# EasyEDA Pro project DCP_main.eprj, schematic Schematic1
Board Name: RCBO; Create Date: 2025-11-18; Page Name: P1; Project Name: DCP_main; Schematic Name: Schematic1; Update Date: 2025-11-24; Company: 嘉立创EDA; Page Size: A4; Version: V1.0
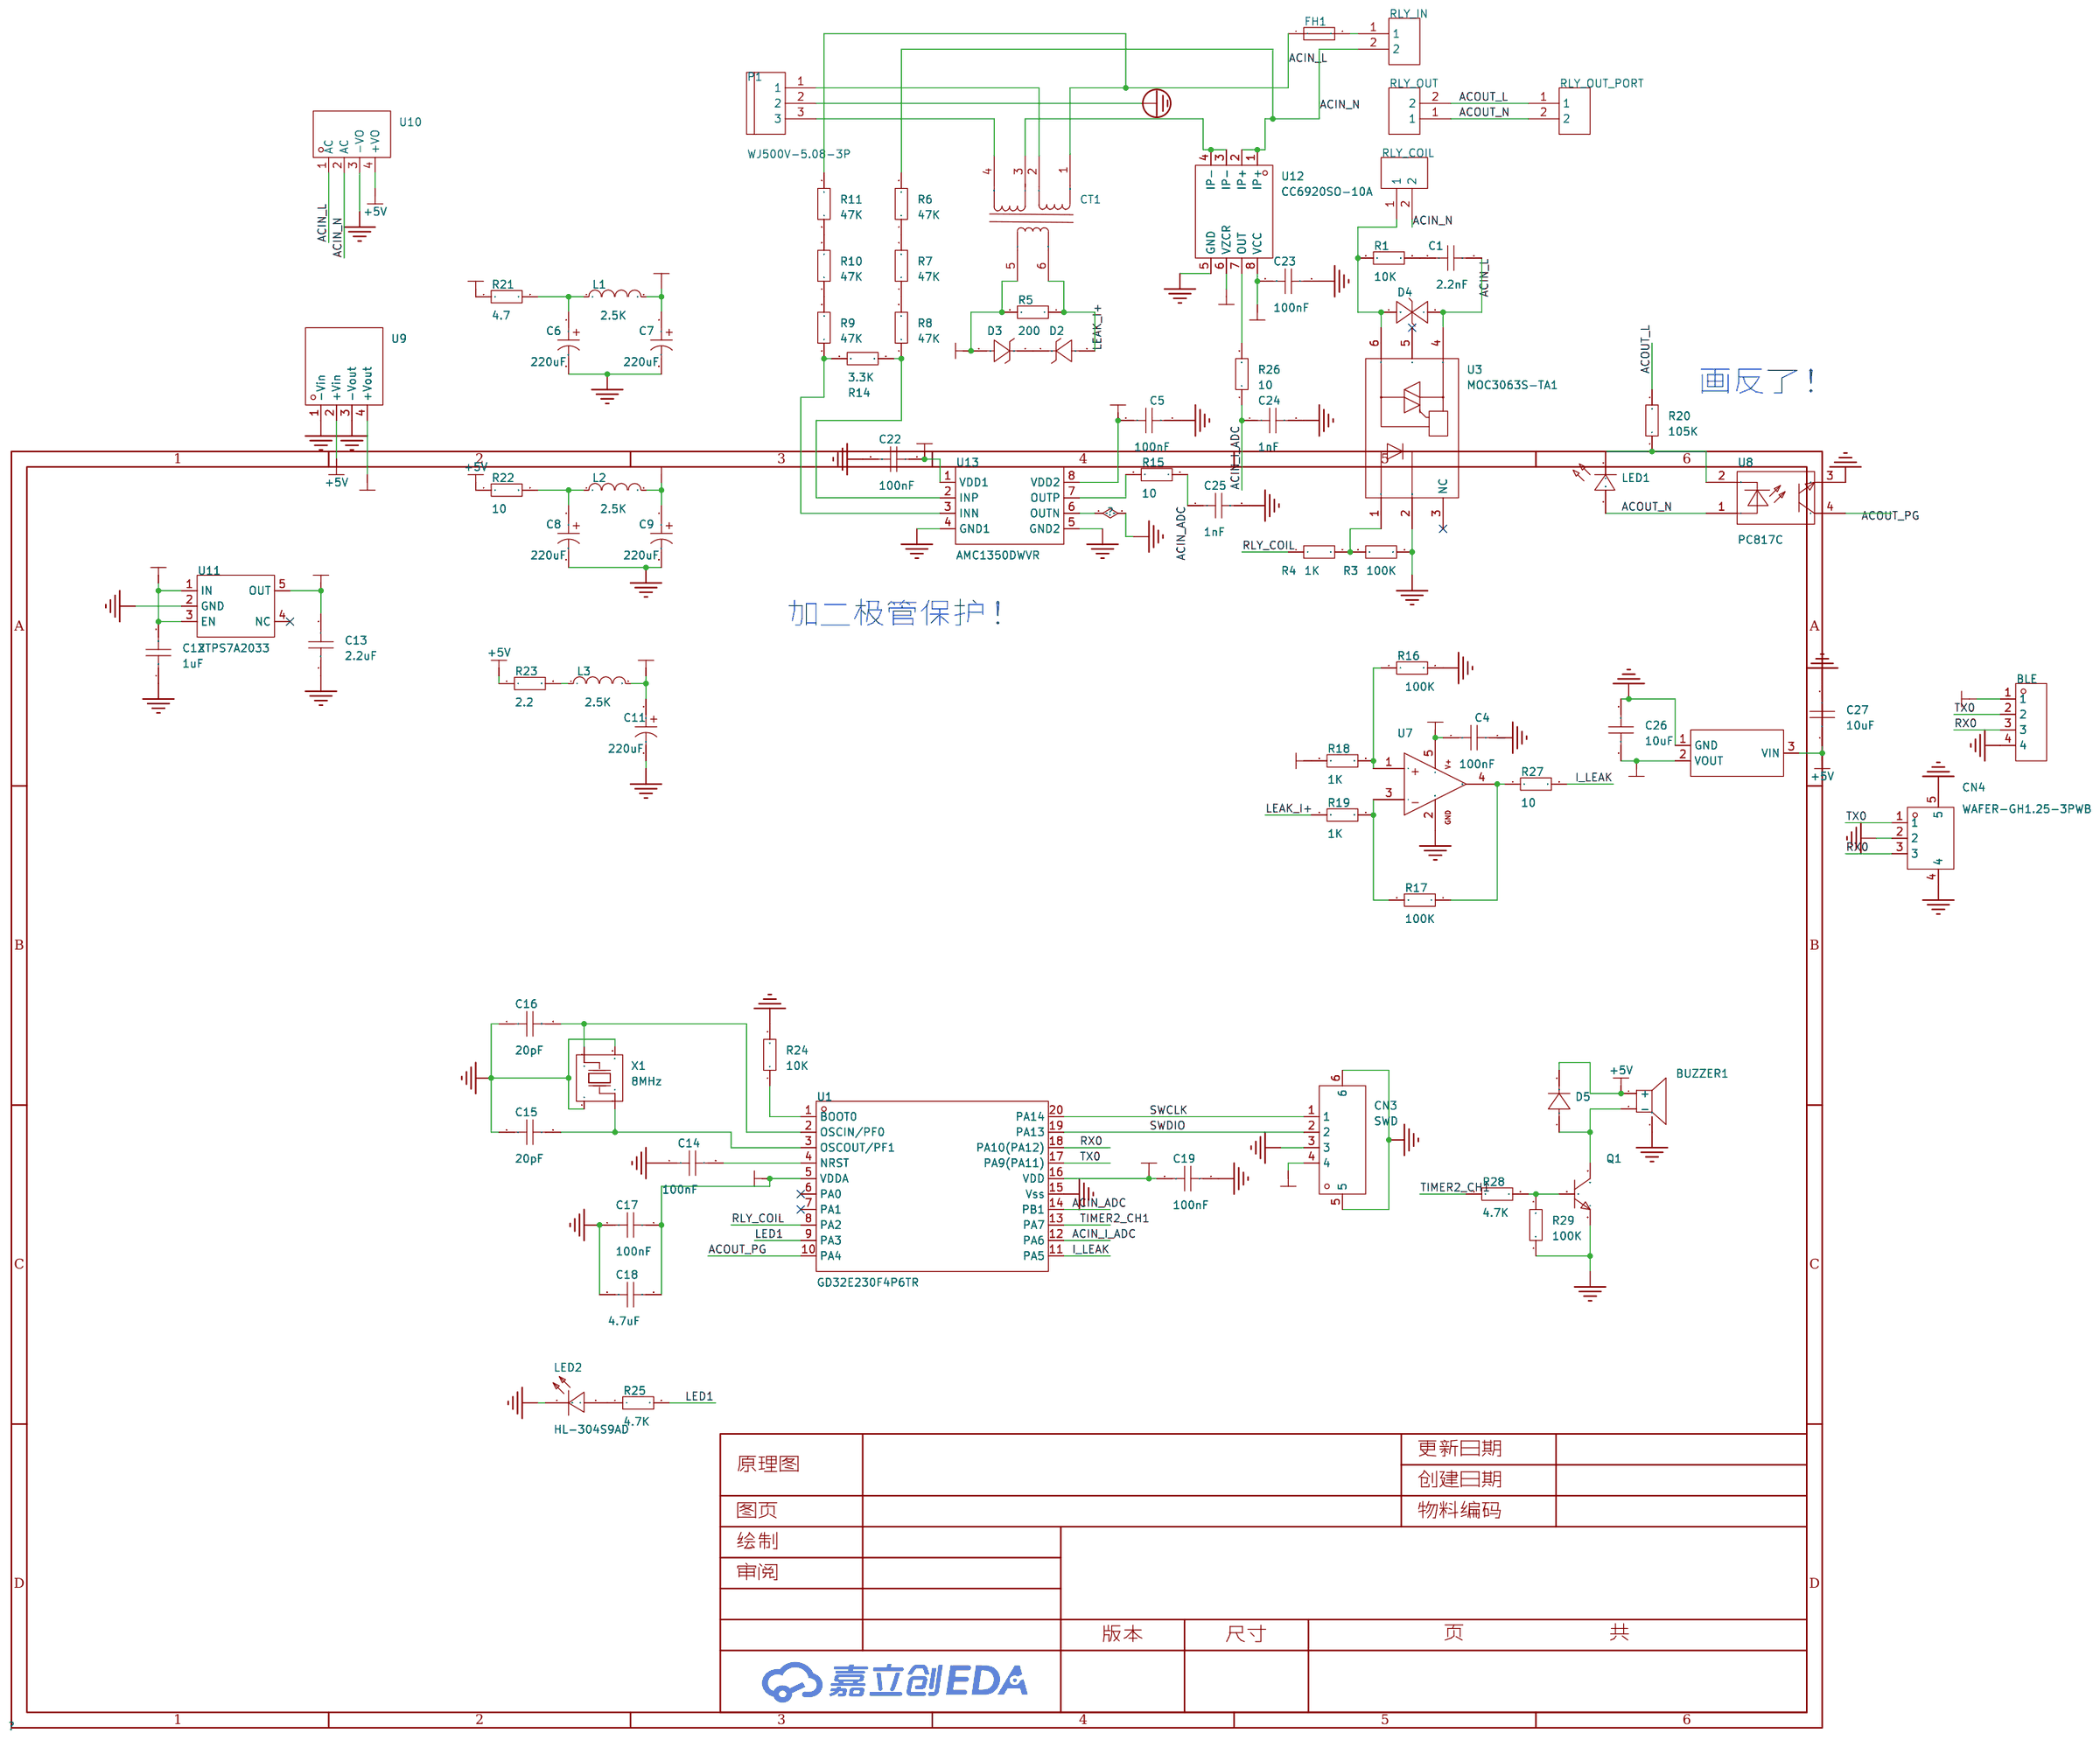
[diagram p0: schematic sheet]

## Parts
BLE  -  [HDR-TH_4P-P2.54-V-F]
BUZZER1  4kHz  [BUZ-SMD_L5.0-W5.5-P4.60]
C1  2.2nF  [CAP-TH_L6.5-W4.0-P5.0-D0.5]
C4  100nF  [C0603]
C5  100nF  [C0603]
C6  220uF  [CAP-SMD_BD6.3-L6.6-W6.6-LS7.4-FD]
C7  220uF  [CAP-SMD_BD6.3-L6.6-W6.6-LS7.4-FD]
C8  220uF  [CAP-SMD_BD6.3-L6.6-W6.6-LS7.4-FD]
C9  220uF  [CAP-SMD_BD6.3-L6.6-W6.6-LS7.4-FD]
C11  220uF  [CAP-SMD_BD6.3-L6.6-W6.6-LS7.4-FD]
C12  1uF  [C0603]
C13  2.2uF  [C0603]
C14  100nF  [C0603]
C15  20pF  [C0603]
C16  20pF  [C0603]
C17  100nF  [C0603]
C18  4.7uF  [C0603]
C19  100nF  [C0603]
C22  100nF  [C0603]
C23  100nF  [C0603]
C24  1nF  [C0603]
C25  1nF  [C0603]
C26  10uF  [C0603]
C27  10uF  [C0603]
CN3  SWD  [CONN-SMD_4P-P1.27_GH125-S04DCA-00]
CN4  WAFER-GH1.25-3PWB  [CONN-TH_3P-P1.25_GH1.25]
CT1  -  [GL-MXNZ06]
D2  ZMM3V3  [LL-34_L3.5-W1.5-RD]
D3  ZMM3V3  [LL-34_L3.5-W1.5-RD]
D4  SMBJ18CA  [SMB_L4.6-W3.6-LS5.3-BI]
D5  1N4148WS  [SOD-323_L1.7-W1.3-LS2.5-FD]
FH1  PTF-15  [FUSE-TH_L22.0-W9.0-P22.60]
L1  2.5K  [L0603]
L2  2.5K  [L0603]
L3  2.5K  [L0603]
LED1  -  [LED_TH-3mm]
LED2  HL-304S9AD  [LED-TH_BD3.0-P2.54-FD]
P1  WJ500V-5.08-3P  [CONN-TH_3P-P5.00_WJ500V-5.08-3P]
Q1  S8050  [SOT-23-3_L3.0-W1.7-P0.95-LS2.9-BR]
R1  10K  [RES_MF1W_L_4.5MM]
R3  100K  [R0603]
R4  1K  [R0603]
R5  200  [R0603]
R6  47K  [R0805]
R7  47K  [R0805]
R8  47K  [R0805]
R9  47K  [R0805]
R10  47K  [R0805]
R11  47K  [R0805]
R14  3.3K  [R0603]
R15  10  [R0603]
R16  100K  [R0603]
R17  100K  [R0603]
R18  1K  [R0603]
R19  1K  [R0603]
R20  105K  [RES_MF1W_L_4.5MM]
R21  4.7  [R0603]
R22  10  [R0603]
R23  2.2  [R0603]
R24  10K  [R0603]
R25  4.7K  [R0603]
R26  10  [R0603]
R27  10  [R0603]
R28  4.7K  [R0603]
R29  100K  [R0603]
RLY_COIL  WJ500V-5.08-2P  [CONN-TH_2P-P5.00_WJ500V-5.08-2P]
RLY_IN  WJ500V-5.08-2P  [CONN-TH_2P-P5.00_WJ500V-5.08-2P]
RLY_OUT  WJ500V-5.08-2P  [CONN-TH_2P-P5.00_WJ500V-5.08-2P]
RLY_OUT_PORT  WJ500V-5.08-2P  [CONN-TH_2P-P5.00_WJ500V-5.08-2P]
U1  GD32E230F4P6TR  [TSSOP-20_L6.5-W4.4-P0.65-LS6.4-BL]
U3  MOC3063S-TA1  [SMD-6_L7.3-W6.5-P2.54-LS10.2-BL]
U7  LMV321IDBVR  [SOT-23-5_L3.0-W1.7-P0.95-LS2.8-BR]
U8  PC817C  [OPTO-SMD-4_L4.6-W6.5-P2.54-LS10.3-TL]
U9  B0505S-1WR3  [PWRM-TH_B0505S-1WR3]
U10  HLK-2M05  [PWRM-TH_HLK-2M05]
U11  XTPS7A2033  [SOT-23-5_L3.0-W1.7-P0.95-LS2.8-BL]
U12  CC6920SO-10A  [SOP-8_L5.0-W4.0-P1.27-LS6.2-BL]
U13  AMC1350DWVR  [SOPW8_L7.5-W5.8-P1.27-LS11.5-TL]
U14  SGM2203-3.3YN3LG/TR  [SOT-23-3_L2.9-W1.3-P1.90-LS2.4-BL-3]
X1  8MHz  [OSC-SMD_4P-L3.2-W2.5-BL]

## Library data of the parts
BLE = HDR-F_2.54_1x4P: Supplier Part: C2718488; Supplier Footprint: 插件
BUZZER1 = MLT-5020: LCSC Part Name: 无源(外部驱动) 电磁式 4kHz; Supplier Part: C94598; Manufacturer: 华能; Supplier Footprint: SMD,5x5mm; JLCPCB Part Class: 扩展库; Datasheet: https://item.szlcsc.com/datasheet/MLT-5020/95796.html; Supplier: LCSC; Driver Circuitry: 无源(外部驱动); Technology: 电磁式; Voltage Rating: 3V; Voltage - Supply: 2V~4V; Current Consumption: 100mA; Sound Pressure Level(SPL): 75dB; Length: 5.2mm; Width: 5.2mm; Height: 2.5mm; Operating Temperature: -20℃~+70℃
C1 = Y5V222M1KV16CC0035: LCSC Part Name: 2.2nF ±20% 1kV; Supplier Part: C2887269; Manufacturer: KNSCHA(科尼盛); Supplier Footprint: 插件,P=5mm; JLCPCB Part Class: 扩展库; Datasheet: https://item.szlcsc.com/datasheet/Y5V222M1KV16CC0035/3103837.html; Supplier: LCSC; Tolerance: ±20%; Voltage Rating: 1kV; Pin Spacing: 5mm; Temperature Coefficient: SL
C4 C5 C12-C19 C22-C27 = CAP_0603: Supplier Footprint: 0603
C6-C9 C11 = JBLM2221M010C058RTM 220UF 10V: LCSC Part Name: 220uF ±20% 10V; Supplier Part: C19270700; Manufacturer: DMBJ(振宝佳); Supplier Footprint: SMD,D6.3xL5.8mm; JLCPCB Part Class: 扩展库; Datasheet: https://item.szlcsc.com/datasheet/JBLM2221M010C058RTM%2520220UF%252010V/20537890.html; Supplier: LCSC; Tolerance: ±20%; Voltage Rating: 10V; Ripple Current: 2.65A@100kHz; Equivalent Series Resistance(ESR): 35mΩ@100kHz; Diameter: 6.3mm; Height - Seated (Max): 5.8mm; Lifetime: 2000hrs@105℃
CN3 = GH125-S04DCA-00: 参考系列:-;间距:1.25mm;插针结构:1x4P;排数:1;每排PIN数:4;行距:-;公母:公型插针;安装方式:卧贴;额定电流:1A;工作温度范围:-25℃~+85℃;; LCSC Part Name: GH1.25卧式贴片 带扣; Supplier Part: C2886767; Manufacturer: JS(钜硕电子); Supplier Footprint: SMD,P=1.25mm; JLCPCB Part Class: Extended Part; Datasheet: https://atta.szlcsc.com/upload/public/pdf/source/20210818/CD11791E5ED3EDF45A7009E9C8A2BD4C.pdf; Supplier: LCSC; Pitch: 1.25mm; Pins Structure: 1x4P; Number of Rows: 1; Number of PINs Per Row: 4; Gender: 公型插针; Mounting Style: 卧贴; Current Rating (Max): 1A; Operating Temperature Range: -25℃~+85℃
CN4 = WAFER-GH1.25-3PWB: LCSC Part Name: 1x3P 间距:1.25mm 卧贴 系列:GH; Supplier Part: C3029378; Manufacturer: XUNPU(讯普); Supplier Footprint: SMD,P=1.25mm,卧贴; JLCPCB Part Class: 扩展库; Datasheet: https://item.szlcsc.com/datasheet/WAFER-GH1.25-3PWB/3561390.html; Supplier: LCSC; Pins Structure: 1x3P; Pitch: 1.25mm; Mounting Type: 卧贴; Reference Series: GH; Number of Pins: 3P; Number of Rows: 1; Number of PINs Per Row: 3; Current Rating: 1A; Contact Material: 黄铜; Contact Plating: 锡; Operating Temperature: -25℃~+85℃; Voltage Rating: 125V; Plastic Material: LCP; Supplementary Features: 辅助焊脚; Color: 米色; Z-Height of the Board: 4.35mm; X-Length of Bottom Edge on Board (Spacing Line): 7mm; Y-Width of Bottom Edge on Board: 5mm
CT1 = 互感器MXNZ06
D2 D3 = ZMM3V3_C707189: LCSC Part Name: 独立式 耐压:3.3V 电流:2uA; Supplier Part: C707189; Manufacturer: Slkor(萨科微); Supplier Footprint: LL-34; JLCPCB Part Class: 扩展库; Datasheet: https://item.szlcsc.com/datasheet/ZMM3V3/744311.html; Supplier: LCSC; Diode Configuration: 独立式; Zener Voltage(Nom): 3.3V; Reverse Leakage Current (Ir): 2uA; Zener Voltage(Range): 3.1V~3.5V; Pd - Power Dissipation: 500mW; Impedance(Zzt): 85Ω; Impedance(Zzk): 600Ω
D4 = SMBJ18CA_C699019: Supplier Part: C699019; Manufacturer: YANGJIE(扬杰); Supplier Footprint: SMB(DO-214AA); JLCPCB Part Class: 扩展库; Datasheet: https://atta.szlcsc.com/upload/public/pdf/source/20190118/C340697_21AC0267120ED75466CB2B39690E90FA.pdf; Supplier: LCSC; Reverse Stand-Off Voltage (Vrwm): 18V; Maximum Clamping Voltage: 29.2V; Peak Pulse Current (Ipp): 20.55A; Peak Pulse Power Dissipation (Ppp): 600W; Breakdown Voltage: 20V; Type: TVS
D5 = 1N4148WS_C7420319: Supplier Part: C7420319; Manufacturer: R+O(宏嘉诚); Supplier Footprint: SOD-323; JLCPCB Part Class: 扩展库; Datasheet: https://item.szlcsc.com/datasheet/1N4148WS/8397141.html; Supplier: LCSC; Diode Configuration: 独立式; Voltage - Forward(Vf@If): 1.25V@150mA; Voltage - DC Reverse(Vr): 100V; Current - Rectified: 150mA; Pd - Power Dissipation: 200mW; Reverse Leakage Current (Ir): 1uA@75V; Reverse Recovery Time (trr): 4ns; Operating Junction Temperature Range: -55℃~+150℃; Non-Repetitive Peak Forward Surge Current: 2A
FH1 = PTF-15: LCSC Part Name: 两件套 保险丝座 5x20mm 白色盖 二件套; Supplier Part: C842712; Manufacturer: XFCN(兴飞); Supplier Footprint: 插件,P=22.6mm; JLCPCB Part Class: 扩展库; Datasheet: https://atta.szlcsc.com/upload/public/pdf/source/20211009/012EEC364944A1D424B5148AD750D865.pdf; Supplier: LCSC; Voltage Rating: 250V; Current Rating: 6.3A
L1-L3 = L_0603
LED1 = LED_TH-R_3mm: Supplier Footprint: 插件
LED2 = HL-304S9AD: 灯头类型:3mm圆形灯头;发光颜色:红色;正向电压(VF):2.2V;功率:66mW;正向电流:20mA;主波长:627nm~635nm;二极管配置:-;透镜颜色:雾状红透镜;色温:-;发光强度:460mcd;发光角度:40°;载带方式:-;工作温度:-30℃~+80℃;; Supplier Part: C568936; Manufacturer: HONGLITRONIC(鸿利光电); Supplier Footprint: 插件,D=3mm; JLCPCB Part Class: 扩展库; Datasheet: https://atta.szlcsc.com/upload/public/pdf/source/20200630/C568936_361459151DDEDF72172B9683A2A9AC96.pdf; Supplier: LCSC; Lamp Holder Type: 3mm圆形灯头; Emitted Color: 红色; Forward Voltage (VF): 2.2V; Power Dissipation: 66mW; Forward Current: 20mA; Dominant Wavelength: 627nm~635nm; Lens Color: 雾状红透镜; Luminous Intensity: 460mcd; Viewing Angle: 40°; Operating Temperature: -30℃~+80℃
P1 = WJ500V-5.08-3P: LCSC Part Name: 5.08mm 1x3P 排数:1 每排P数:3 直插; Supplier Part: C72334; Manufacturer: KANGNEX(康奈克斯电气); Supplier Footprint: 插件,P=5.08mm; JLCPCB Part Class: 扩展库; Datasheet: https://item.szlcsc.com/datasheet/WJ500V-5.08-3P/73443.html; Supplier: LCSC; Number of Positions or Pins: 1x3P; Pitch: 5.08mm; Color: 绿色; Mounting Type: 直插; Number of Pins: 3P; Number of Rows: 1; Number of PINs Per Row: 3; Current Rating: 18A; Voltage Rating (Max): 250V; Wire Gauge - AWG: 14~30; Wire Gauge - mm2: 2.5; Operating Temperature: -40℃~+105℃
Q1 = S8050_C364312: LCSC Part Name: hFE:200-350 NPN 电流:500mA 电压:25V; Supplier Part: C364312; Manufacturer: MDD(辰达半导体); Supplier Footprint: SOT-23; JLCPCB Part Class: 扩展库; Datasheet: https://item.szlcsc.com/datasheet/S8050/338624.html; Supplier: LCSC; type: NPN; Current - Collector(Ic): 500mA; Collector - Emitter Voltage VCEO: 25V; Pd - Power Dissipation: 300mW; Transition frequency(fT): 150MHz; Current - Collector Cutoff: 100nA; Vce Saturation(VCE(sat)): 600mV@500mA,50mA; Operating Temperature: -55℃~+150℃; Emitter-Base Voltage(Vebo): 5V
R1 R3-R5 R14-R29 = Res_0603: Supplier Footprint: 0603
R6-R11 = Res_0805: Supplier Footprint: 0805
RLY_COIL RLY_IN RLY_OUT RLY_OUT_PORT = WJ500V-5.08-2P: LCSC Part Name: 1x2P 5.08mm 直插 排数:1 每排P数:2; Supplier Part: C8465; Manufacturer: KANGNEX(康奈克斯电气); Supplier Footprint: 插件,P=5.08mm; JLCPCB Part Class: 扩展库; Datasheet: https://atta.szlcsc.com/upload/public/pdf/source/20191225/C8465_02D34CE5B5B4A53DF5891601D97FA9F4.pdf; Supplier: LCSC; Structure: 1x2P; Pitch: 5.08mm; Color: 绿色; Mounting Style: 直插; Current Rating (Max): 18A; Voltage Rating (Max): 250V; Number of Pins: 2P; Number of Rows: 1; Wire Gauge - AWG: 14~30; Wire Gauge - mm2: 2.5; Number of PINs Per Row: 2; Operating Temperature Range: -40℃~+105℃; Screw Specification: M2.5
U1 = GD32E230F4P6TR: CPU内核:-;程序存储容量:16KB;RAM总容量:4KB;GPIO端口数量:15;工作电压范围:1.8V~3.6V;CPU最大主频:72MHz;程序存储器类型:FLASH;; Supplier Part: C2842295; Manufacturer: GigaDevice(兆易创新); Supplier Footprint: TSSOP-20; JLCPCB Part Class: 扩展库; Datasheet: https://atta.szlcsc.com/upload/public/pdf/source/20240402/A7F4CC4CD3D7DC7CD15A7FB0DE571B27.pdf; Supplier: LCSC; Program Storage Size: 16KB; RAM Size: 4KB; GPIO Ports Number: 15; Operating Voltage Range: 1.8V~3.6V; CPU Maximum Speed: 72MHz; Program Memory Type: FLASH; Operating Temperature Range: -40℃~+85℃; ADC (Bit): 12bit; PWM (Bit): 16bit; 16Bit Timer: 5; UART/USART: 1; I2C: 1; SPI: 1; Internal Comparator: 有; Peripheral/Function: 温度传感器；DMA；看门狗；LIN总线协议；PWM；IrDA；RTC实时时钟; Watchdog: 有; Real-Time Clock: 有; Infrared Data Association: 有; Direct Memory Access: 有; Internal Oscillator: 有
U3 = MOC3063S-TA1: LCSC Part Name: 双向可控硅 有过零电路 1通道; Supplier Part: C77950; Manufacturer: LITEON(光宝); Supplier Footprint: SMD-6P; JLCPCB Part Class: 扩展库; Datasheet: https://item.szlcsc.com/datasheet/MOC3063S-TA1/79084.html; Supplier: LCSC; Output Type: 双向可控硅; Zero Crossing Circuit: 有; Voltage - Forward(Vf): 1.4V; Output Current(It(rms)): 1A; Isolation Voltage(Vrms): 5kV; Forward Current: 20mA; Load Voltage: 600V; Static dv/dt: 1000V/us; Number of Channels: 1; Operating Temperature: -40℃~+100℃; Power Dissipation: 250mW; Number of terminals: 6
U7 = LMV321IDBVR_C7972: LCSC Part Name: 低电压轨到轨输出运算放大器; Supplier Part: C7972; Manufacturer: TI(德州仪器); Supplier Footprint: SOT-23-5; JLCPCB Part Class: 扩展库; Datasheet: https://www.ti.com/cn/lit/gpn/lmv321; Supplier: LCSC; Number of Channels: 单路; Maximum Power Supply Range (Vdd-Vss): 5.5V; Rail to Rail: 轨到轨输出; Gain Bandwidth Product: 1MHz; Vos - Input Offset Voltage: 7mV; Input Offset Voltage Drift(Vos TC): 9uV/℃; Slew Rate: 1V/us; Ib - Input Bias Current: 11nA; Input Offset Current(Ios): 5nA; Noise density(eN): 46nV/√Hz@1kHz; Common Mode Rejection Ratio(CMRR): 63dB; Quiescent Current: 170uA; Output Current: 5mA; Operating Temperature: -40℃~+125℃; Single supply: 2.7V~5.5V
U8 = PC817C_C3025164: LCSC Part Name: C档 光电晶体管光电耦合器; Supplier Part: C3025164; Manufacturer: GOODWORK(固得沃克); Supplier Footprint: SMD-4P; JLCPCB Part Class: 扩展库; Datasheet: https://item.szlcsc.com/datasheet/PC817C/3553773.html; Supplier: LCSC; Input type: DC; Output Type: 光电三极管; Voltage - Forward(Vf): 1.2V; Output Current: 50mA; Isolation Voltage(Vrms): 5kV; Reverse Voltage: 6V; Load Voltage: 35V; Number of Outputs: 1; Vce Saturation(VCE(sat)): 100mV@1mA,20mA; Rise time: 6us@2mA,100Ω; Fall time: 5us; Operating Temperature: -55℃~+110℃; Current Transfer Ratio (CTR) Minimum: 200%; Current Transfer Ratio (CTR) Maximum/Saturation Value: 400%; Forward Current(If): 50mA
U9 = B0505S-1WR3_C7465178: LCSC Part Name: DC-DC输入5V输出5V200mA 1W输出短路保护; Supplier Part: C7465178; Manufacturer: EVISUN(易成); Supplier Footprint: SIP,11.7x6mm; JLCPCB Part Class: 扩展库; Datasheet: https://item.szlcsc.com/datasheet/B0505S-1WR3/8505845.html; Supplier: LCSC; Output Power: 1W; Voltage - Supply: 4.5V~5.5V; Conversion Efficiency: 86%; Output Voltage: 5V; Output Current(Max): 200mA; Capacitive Load(Max): 2400uF; Isolation Voltage(Vrms): 1.5kV; Features: 短路保护
U10 = HLK-2M05: LCSC Part Name: 2W超小型系列模块电源; Supplier Part: C209909; Manufacturer: HI-LINK(海凌科); Supplier Footprint: SIP,30x16mm; JLCPCB Part Class: 扩展库; Datasheet: https://item.szlcsc.com/datasheet/HLK-2M05/210987.html; Supplier: LCSC; Conversion Type: AC-DC; Voltage - Input(AC): 90VAC~245VAC; Output Voltage: 5V; Output Current(Max): 400mA; Output Power: 2W; Quiescent Dissipation: 0.1W; Ripple Noise: 50mVp-p; Features: 过流保护；短路保护; Isolation Voltage(Vrms): 3kV; Length: 30mm; Width: 16mm; Height: 19mm
U11 = XTPS7A2033: LCSC Part Name: 超低噪声300-mA,3.3V固定输出电压,低压差线性稳压器(LDO); Supplier Part: C51953290; Manufacturer: SiChange(芯昌科技); Supplier Footprint: SOT-23-5; JLCPCB Part Class: 扩展库; Datasheet: https://item.szlcsc.com/datasheet/XTPS7A2033/54680474.html; Supplier: LCSC; Output Type: 固定; Voltage - Supply: 5.5V; Output Voltage: 3.3V; Output Current: 300mA; Power Supply Rejection Ratio (PSRR): 62dB@(1kHz); Voltage Dropout: 160mV@(300mA); standby current: 15uA; Noise: 9uVrms; Features: 过流保护；带使能；过热保护; Operating Temperature: -40℃~+125℃; Output Configuration: 正极; Number of Outputs: 1
U12 = CC6920SO-10A: Supplier Part: C2760488; Manufacturer: CrossChip(成都芯进); Supplier Footprint: SOP-8; JLCPCB Part Class: 扩展库; Datasheet: https://item.szlcsc.com/datasheet/CC6920SO-10A/2881675.html; Supplier: LCSC; Current Range: -10A~10A; Voltage - Supply: 5V; Isolation Voltage(Vrms): 3500Vrms; Sensitivity: 200mV/A; Standby Current: 20mA; Operating Temperature: -40℃~+125℃
U13 = AMC1350DWVR: Supplier Part: C4990162; Manufacturer: TI(德州仪器); Supplier Footprint: SOIC-8; JLCPCB Part Class: 扩展库; Datasheet: https://www.ti.com/cn/lit/gpn/amc1350; Supplier: LCSC
U14 = SGM2203-3.3YN3LG/TR: Supplier Part: C4555486; Manufacturer: SGMICRO(圣邦微); Supplier Footprint: SOT-23-3; JLCPCB Part Class: Extended Part; Datasheet: https://item.szlcsc.com/datasheet/SGM2203-3.3YN3LG%252FTR/5127157.html; Supplier: LCSC; Output Type: 固定; Voltage - Supply: 36V; Output Voltage: 3.3V; Output Current: 150mA; Power Supply Rejection Ratio (PSRR): 55dB@(1kHz); Voltage Dropout: 2.4V@(150mA); standby current: 4.2uA; Features: 过流保护；过热保护; Operating Temperature: -40℃~+85℃@(Ta); Output Configuration: 正极; Number of Outputs: 1
X1 = TAXM8M4RDBCCT2T: 晶振类型:贴片晶振;频率:8MHz;常温频差:±10ppm;外接负载电容:10pF;频率稳定度(全温):±15ppm;; LCSC Part Name: 8MHz ±10ppm 10pF; Supplier Part: C400090; Manufacturer: YJX(雅晶鑫); Supplier Footprint: SMD3225-4P; JLCPCB Part Class: 扩展库; Datasheet: https://atta.szlcsc.com/upload/public/pdf/source/20190626/C400090_CF95B89E745AFE4EF2E392EF8AC009D6.pdf; Supplier: LCSC; Crystal Type: 贴片晶振; Normal temperature Frequency Tolerance: ±10ppm; External load capacitor: 10pF; Frequency Stability(Full temperature range): ±15ppm; Equivalent Series Resistance (ESR): 250Ω; Operating Temperature: -40℃~+85℃

## Nets
+3.3V: C5.2 C13.2 C17.1 C18.1 C19.2 C23.2 CN3.4 U1.5(VDDA) U1.16(VDD) U11.5(OUT) U12.8(VCC) U13.8(VDD2)
+3.3V_2: BLE.1 C26.1 U14.2(VOUT)
+5V: BUZZER1.1(+) C27.1 D5.2(K) R22.1 R23.1 U9.2(+Vin) U10.4(+VO) U14.3(VIN)
+5V_1: C7.1 C22.1 L1.2 U13.1(VDD1)
+5V_2: C4.1 C9.1 L2.2 U7.5(V+)
+5V_3: C11.1 C12.2 L3.2 U11.1(IN) U11.3(EN)
+5V_4: R21.1 U9.4(+Vout)
GND: BLE.4 BUZZER1.3(NC) C4.2 C5.1 C8.2 C9.2 C11.2 C12.1 C13.1 C14.1 C15.1 C16.1 C17.2 C18.2 C19.1 C23.1 C24.2 C25.2 C26.2 C27.2 CN3.3 CN3.5 CN3.6 CN4.2 CN4.4 CN4.5 LED2.2(C) Q1.2(E) R3.2 R16.2 R24.2 R29.1 U1.15(Vss) U3.2(CAT) U7.2(GND) U8.3 U9.1(-Vin) U10.3(-VO) U11.2(GND) U12.5(GND) U13.5(GND2) U13.6(OUTN) U14.1(GND) X1.2 X1.4
GND2: C6.2 C7.2 C22.2 U9.3(-Vout) U13.4(GND1)
PGND: P1.2
ACIN_ADC: C25.1 R15.1 U1.14(PB1)
ACIN_I_ADC: C24.1 R26.1 U1.12(PA6)
ACIN_L: C1.2 CT1.1(5) D4.2(A) FH1.1 R11.2 U3.4(MT) U10.1(AC)
ACIN_N: R6.2 RLY_COIL.2 RLY_IN.2 U10.2(AC) U12.1(IP+) U12.2(IP+)
ACOUT_L: R20.2 RLY_OUT.2 RLY_OUT_PORT.1
ACOUT_N: LED1.1(C) RLY_OUT.1 RLY_OUT_PORT.2 U8.1
ACOUT_PG: U1.10(PA4) U8.4
I_LEAK: R27.2 U1.11(PA5)
LEAK_I+: CT1.6(3) D2.2(A) R5.1 R19.1
LED1: R25.2 U1.9(PA3)
RLY_COIL: R4.1 U1.8(PA2)
RX0: BLE.3 CN4.3 U1.18(PA10(PA12))
SWCLK: CN3.1 U1.20(PA14)
SWDIO: CN3.2 U1.19(PA13)
TIMER2_CH1: R28.1 U1.13(PA7)
TX0: BLE.2 CN4.1 U1.17(PA9(PA11))
VREF: CT1.5(4) D3.2(A) R5.2 R18.1 U12.6(VZCR)
$1N739: FH1.2 RLY_IN.1
$1N1036: D4.1(C) R1.1 RLY_COIL.1 U3.6(MT)
$1N1457: C1.1 R1.2
$1N1767: R3.1 R4.2 U3.1(AN)
$1N2417: CT1.2(6) P1.1
$1N2505: D2.1(C) D3.1(C)
$1N3337: R6.1 R7.2
$1N3339: R10.2 R11.1
$1N3341: R9.2 R10.1
$1N3343: R7.1 R8.2
$1N4877: R15.2 U13.7(OUTP)
$1N4891: CT1.4(8) P1.3
$1N5300: R17.2 R19.2 U7.3(-)
$1N5307: R17.1 R27.1 U7.4(OUT)
$1N5316: R16.1 R18.2 U7.1(+)
$1N5629: LED1.2(A) R20.1 U8.2
$1N6158: C6.1 L1.1 R21.2
$1N6428: C8.1 L2.1 R22.2
$1N6591: L3.1 R23.2
$1N7664: C16.2 U1.2(OSCIN/PF0) X1.3
$1N7665: C15.2 U1.3(OSCOUT/PF1) X1.1
$1N7667: R24.1 U1.1(BOOT0)
$1N7674: C14.2 U1.4(NRST)
$1N7687: LED2.1(A) R25.1
$1N12357: R9.1 R14.2 U13.3(INN)
$1N12365: R8.1 R14.1 U13.2(INP)
$1N12518: R26.2 U12.7(OUT)
$1N13107: CT1.3(7) U12.3(IP-) U12.4(IP-)
$1N13672: BUZZER1.2(-) D5.1(A) Q1.3(C)
$1N13840: Q1.1(B) R28.2 R29.2

Not connected (* = marked no-connect by the designer): U1 6(PA0)* 7(PA1)*; U3 3(NC)* 5(NC)*; U11 4(NC)*

## Notes on the sheet
- 画反了！
- 加二极管保护！
